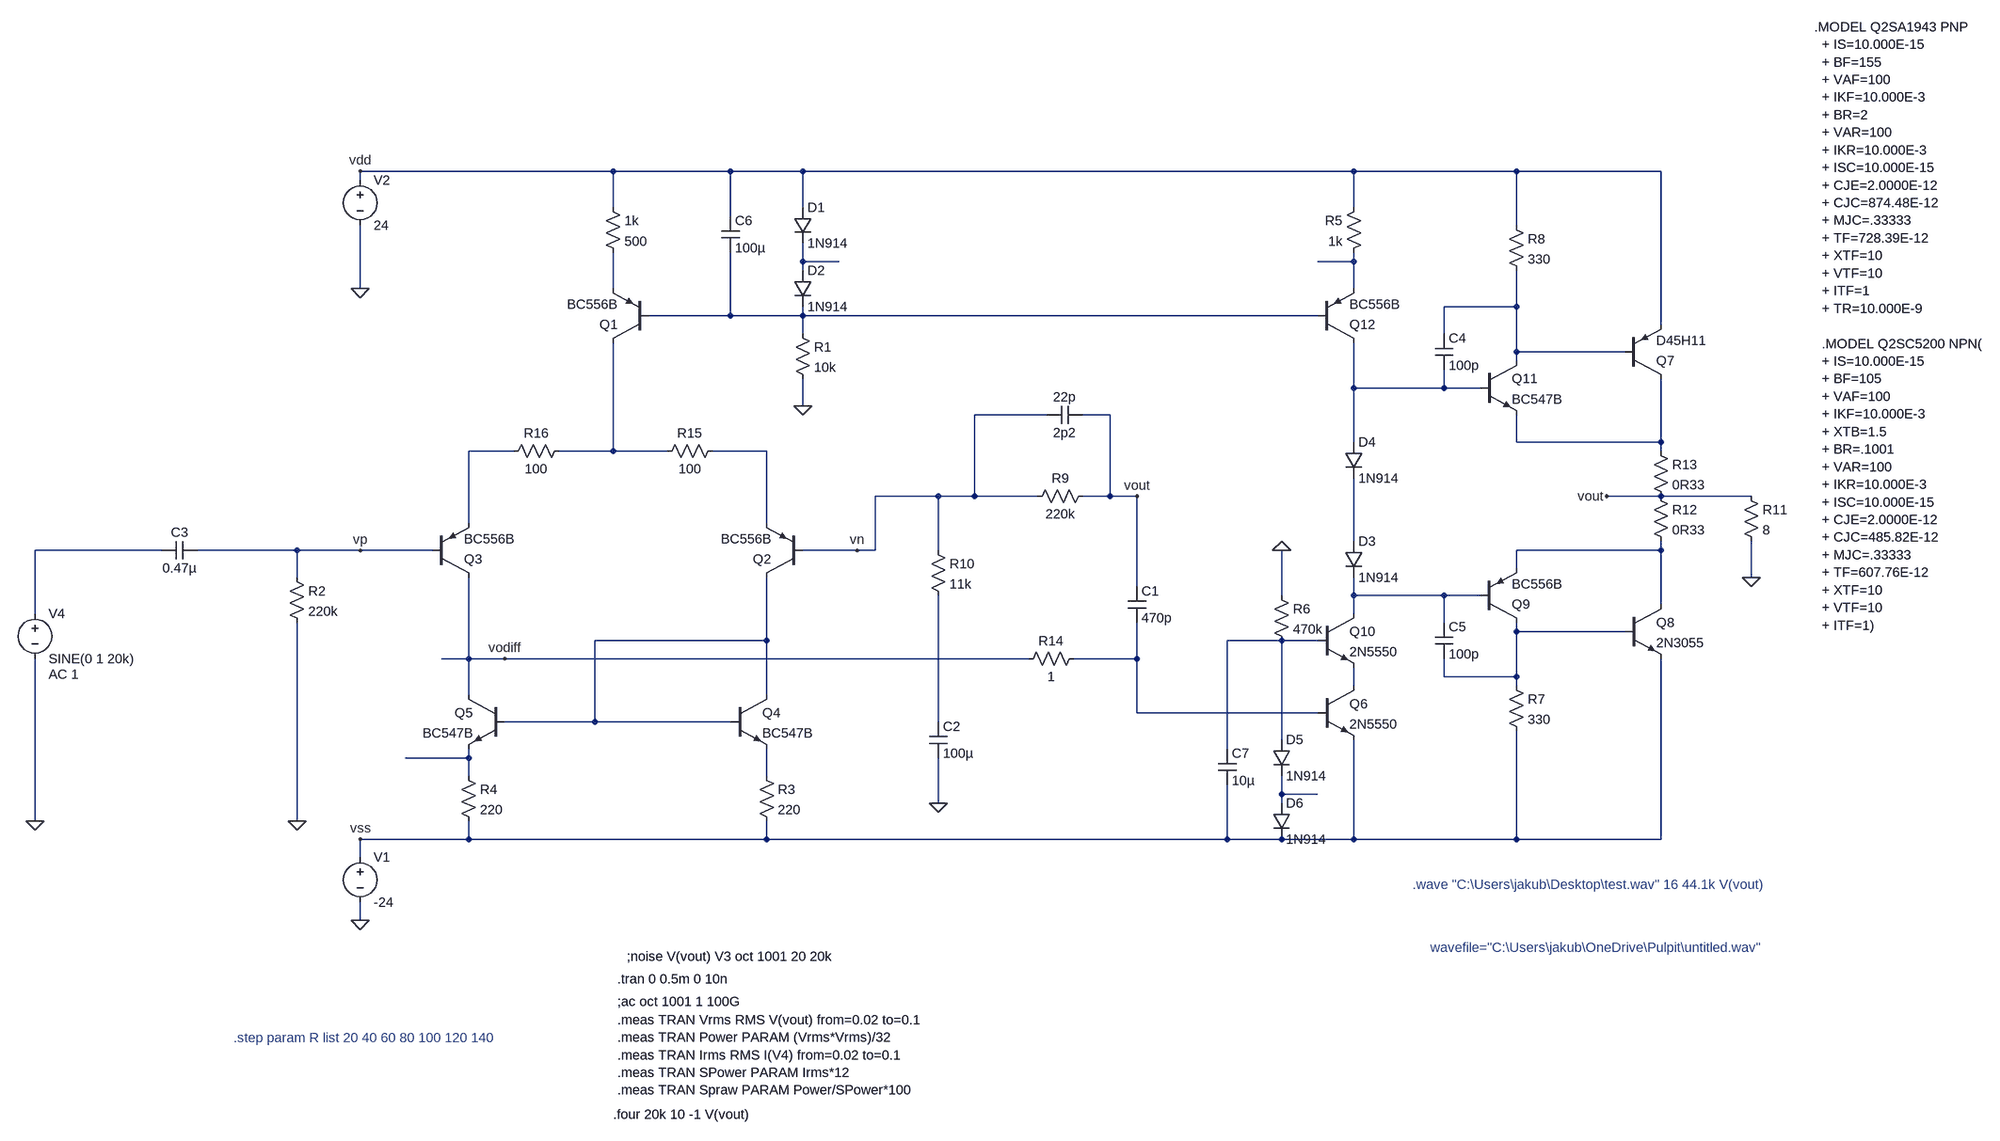
[diagram p0: schematic Draft7.asc]
Draft7.asc, the LTspice schematic file:
Version 4
SHEET 1 2016 2028
WIRE -416 -544 -864 -544
WIRE -208 -544 -416 -544
WIRE -80 -544 -208 -544
WIRE 896 -544 -80 -544
WIRE 1184 -544 896 -544
WIRE 1440 -544 1184 -544
WIRE -864 -528 -864 -544
WIRE -416 -480 -416 -544
WIRE -80 -480 -80 -544
WIRE 896 -480 896 -544
WIRE -208 -464 -208 -544
WIRE 1184 -448 1184 -544
WIRE -80 -384 -80 -416
WIRE -16 -384 -80 -384
WIRE 896 -384 896 -400
WIRE 896 -384 832 -384
WIRE -80 -368 -80 -384
WIRE -864 -336 -864 -448
WIRE -416 -336 -416 -400
WIRE 896 -336 896 -384
WIRE 1184 -304 1184 -368
WIRE 1184 -304 1056 -304
WIRE -208 -288 -208 -400
WIRE -208 -288 -352 -288
WIRE -80 -288 -80 -304
WIRE -80 -288 -208 -288
WIRE 832 -288 -80 -288
WIRE 1440 -272 1440 -544
WIRE -80 -256 -80 -288
WIRE 1056 -256 1056 -304
WIRE 1184 -224 1184 -304
WIRE 1376 -224 1184 -224
WIRE 1184 -208 1184 -224
WIRE 896 -160 896 -240
WIRE 1056 -160 1056 -192
WIRE 1056 -160 896 -160
WIRE 1120 -160 1056 -160
WIRE -80 -128 -80 -176
WIRE 352 -112 224 -112
WIRE 464 -112 416 -112
WIRE 896 -64 896 -160
WIRE 1184 -64 1184 -112
WIRE 1440 -64 1440 -176
WIRE 1440 -64 1184 -64
WIRE -592 -48 -672 -48
WIRE -416 -48 -416 -240
WIRE -416 -48 -512 -48
WIRE -320 -48 -416 -48
WIRE -144 -48 -240 -48
WIRE 1440 -48 1440 -64
WIRE 160 32 48 32
WIRE 224 32 224 -112
WIRE 224 32 160 32
WIRE 336 32 224 32
WIRE 464 32 464 -112
WIRE 464 32 416 32
WIRE 512 32 464 32
WIRE 1440 32 1344 32
WIRE 1600 32 1440 32
WIRE -672 80 -672 -48
WIRE -144 80 -144 -48
WIRE 896 112 896 0
WIRE -1216 128 -1440 128
WIRE -976 128 -1152 128
WIRE -864 128 -976 128
WIRE -736 128 -864 128
WIRE 16 128 -80 128
WIRE 48 128 48 32
WIRE 48 128 16 128
WIRE 160 128 160 32
WIRE 1440 128 1440 112
WIRE 1440 128 1184 128
WIRE 1184 160 1184 128
WIRE -976 176 -976 128
WIRE 1600 176 1600 112
WIRE 512 192 512 32
WIRE 768 208 768 128
WIRE 896 208 896 176
WIRE 1056 208 896 208
WIRE 1120 208 1056 208
WIRE 1440 224 1440 128
WIRE -1440 240 -1440 128
WIRE 896 240 896 208
WIRE 1056 256 1056 208
WIRE 1184 272 1184 256
WIRE 1376 272 1184 272
WIRE -144 288 -144 176
WIRE -144 288 -448 288
WIRE 768 288 672 288
WIRE 832 288 768 288
WIRE -672 320 -672 176
WIRE -672 320 -720 320
WIRE -608 320 -672 320
WIRE 320 320 -608 320
WIRE 512 320 512 256
WIRE 512 320 400 320
WIRE 1056 352 1056 320
WIRE 1184 352 1184 272
WIRE 1184 352 1056 352
WIRE 896 368 896 336
WIRE 1184 368 1184 352
WIRE -672 384 -672 320
WIRE -144 384 -144 288
WIRE 512 416 512 320
WIRE 832 416 512 416
WIRE -448 432 -448 288
WIRE -448 432 -608 432
WIRE -208 432 -448 432
WIRE 160 432 160 208
WIRE 768 464 768 288
WIRE 672 480 672 288
WIRE -672 496 -672 480
WIRE -672 496 -784 496
WIRE -672 528 -672 496
WIRE -144 528 -144 480
WIRE 768 560 768 528
WIRE 832 560 768 560
WIRE 160 576 160 496
WIRE 768 576 768 560
WIRE -1440 608 -1440 320
WIRE -976 608 -976 256
WIRE -672 640 -672 608
WIRE -672 640 -864 640
WIRE -144 640 -144 608
WIRE -144 640 -672 640
WIRE 672 640 672 544
WIRE 672 640 -144 640
WIRE 768 640 672 640
WIRE 896 640 896 464
WIRE 896 640 768 640
WIRE 1184 640 1184 448
WIRE 1184 640 896 640
WIRE 1440 640 1440 320
WIRE 1440 640 1184 640
WIRE -864 672 -864 640
WIRE -864 784 -864 752
FLAG -864 -544 vdd
FLAG -1440 608 0
FLAG -864 640 vss
FLAG 1344 32 vout
FLAG 1600 176 0
FLAG -864 784 0
FLAG -80 -128 0
FLAG -864 -336 0
FLAG 768 128 0
FLAG 160 576 0
FLAG -864 128 vp
FLAG 16 128 vn
FLAG -608 320 vodiff
FLAG 512 32 vout
FLAG -976 608 0
DATAFLAG -704 320 ""
DATAFLAG 1552 32 ""
DATAFLAG 160 640 ""
DATAFLAG 128 -544 ""
DATAFLAG 832 -384 ""
DATAFLAG 688 288 ""
DATAFLAG -784 128 ""
DATAFLAG -48 128 ""
DATAFLAG -256 -288 ""
DATAFLAG -416 -368 ""
DATAFLAG 896 352 ""
DATAFLAG -784 496 ""
DATAFLAG 1024 208 ""
DATAFLAG 992 -160 ""
SYMBOL diode -96 -480 R0
SYMATTR InstName D1
SYMATTR Value 1N914
SYMBOL diode -96 -368 R0
SYMATTR InstName D2
SYMATTR Value 1N914
SYMBOL res -96 -272 R0
SYMATTR InstName R1
SYMATTR Value 10k
SYMBOL pnp -352 -240 R180
SYMATTR InstName Q1
SYMATTR Value BC556B
SYMBOL res -432 -496 R0
SYMATTR InstName 1k
SYMATTR Value 500
SYMBOL pnp -80 176 R180
SYMATTR InstName Q2
SYMATTR Value BC556B
SYMBOL pnp -736 176 M180
SYMATTR InstName Q3
SYMATTR Value BC556B
SYMBOL voltage -864 656 R0
WINDOW 123 0 0 Left 0
WINDOW 39 0 0 Left 0
SYMATTR InstName V1
SYMATTR Value -24
SYMBOL npn -208 384 R0
SYMATTR InstName Q4
SYMATTR Value BC547B
SYMBOL npn -608 384 M0
SYMATTR InstName Q5
SYMATTR Value BC547B
SYMBOL npn 832 368 R0
SYMATTR InstName Q6
SYMATTR Value 2N5550
SYMBOL diode 880 112 R0
SYMATTR InstName D3
SYMATTR Value 1N914
SYMBOL diode 880 -64 R0
SYMATTR InstName D4
SYMATTR Value 1N914
SYMBOL res 1168 352 R0
SYMATTR InstName R7
SYMATTR Value 330
SYMBOL res 1168 -464 R0
SYMATTR InstName R8
SYMATTR Value 330
SYMBOL pnp 1120 256 M180
SYMATTR InstName Q9
SYMATTR Value BC556B
SYMBOL npn 1120 -208 R0
SYMATTR InstName Q11
SYMATTR Value BC547B
SYMBOL voltage -864 -544 R0
WINDOW 123 0 0 Left 0
WINDOW 39 0 0 Left 0
SYMATTR InstName V2
SYMATTR Value 24
SYMBOL res 1584 16 R0
SYMATTR InstName R11
SYMATTR Value 8
SYMBOL res 1424 16 R0
SYMATTR InstName R12
SYMATTR Value 0R33
SYMBOL res 1424 -64 R0
SYMATTR InstName R13
SYMATTR Value 0R33
SYMBOL pnp 1376 -176 M180
SYMATTR InstName Q7
SYMATTR Value D45H11
SYMBOL npn 1376 224 R0
SYMATTR InstName Q8
SYMATTR Value 2N3055
SYMBOL cap 1040 256 R0
SYMATTR InstName C5
SYMATTR Value 100p
SYMBOL diode 752 464 R0
SYMATTR InstName D5
SYMATTR Value 1N914
SYMBOL diode 752 576 R0
SYMATTR InstName D6
SYMATTR Value 1N914
SYMBOL res 752 192 R0
SYMATTR InstName R6
SYMATTR Value 470k
SYMBOL cap 496 192 R0
SYMATTR InstName C1
SYMATTR Value 470p
SYMBOL pnp 832 -240 M180
SYMATTR InstName Q12
SYMATTR Value BC556B
SYMBOL res 912 -496 M0
SYMATTR InstName R5
SYMATTR Value 1k
SYMBOL res 432 16 R90
WINDOW 0 0 56 VBottom 2
WINDOW 3 32 56 VTop 2
SYMATTR InstName R9
SYMATTR Value 220k
SYMBOL res 144 112 R0
SYMATTR InstName R10
SYMATTR Value 11k
SYMBOL cap 144 432 R0
SYMATTR InstName C2
SYMATTR Value 100µ
SYMBOL cap -224 -464 R0
SYMATTR InstName C6
SYMATTR Value 100µ
SYMBOL cap 656 480 R0
SYMATTR InstName C7
SYMATTR Value 10µ
SYMBOL res -688 512 R0
SYMATTR InstName R4
SYMATTR Value 220
SYMBOL res -160 512 R0
SYMATTR InstName R3
SYMATTR Value 220
SYMBOL voltage -1440 224 R0
WINDOW 123 24 124 Left 2
WINDOW 39 0 0 Left 0
SYMATTR Value2 AC 1
SYMATTR InstName V4
SYMATTR Value SINE(0 1 20k)
SYMBOL res -224 -64 R90
WINDOW 0 0 56 VBottom 2
WINDOW 3 32 56 VTop 2
SYMATTR InstName R15
SYMATTR Value 100
SYMBOL res -496 -64 R90
WINDOW 0 0 56 VBottom 2
WINDOW 3 32 56 VTop 2
SYMATTR InstName R16
SYMATTR Value 100
SYMBOL cap 1040 -256 R0
SYMATTR InstName C4
SYMATTR Value 100p
SYMBOL cap 416 -128 R90
WINDOW 0 0 32 VBottom 2
WINDOW 3 32 32 VTop 2
SYMATTR InstName 22p
SYMATTR Value 2p2
SYMBOL res -992 160 R0
SYMATTR InstName R2
SYMATTR Value 220k
SYMBOL cap -1152 112 R90
WINDOW 0 0 32 VBottom 2
WINDOW 3 32 32 VTop 2
SYMATTR InstName C3
SYMATTR Value 0.47µ
SYMBOL res 416 304 R90
WINDOW 0 0 56 VBottom 2
WINDOW 3 32 56 VTop 2
SYMATTR InstName R14
SYMATTR Value 1
SYMBOL npn 832 240 R0
SYMATTR InstName Q10
SYMATTR Value 2N5550
TEXT -408 928 Left 2 !;ac oct 1001 1 100G
TEXT -408 960 Left 2 !.meas TRAN Vrms RMS V(vout) from=0.02 to=0.1\n.meas TRAN Power PARAM (Vrms*Vrms)/32\n.meas TRAN Irms RMS I(V4) from=0.02 to=0.1\n.meas TRAN SPower PARAM Irms*12\n.meas TRAN Spraw PARAM Power/SPower*100
TEXT 1712 -800 Left 2 !.MODEL Q2SA1943 PNP\n  + IS=10.000E-15\n  + BF=155\n  + VAF=100\n  + IKF=10.000E-3\n  + BR=2\n  + VAR=100\n  + IKR=10.000E-3\n  + ISC=10.000E-15\n  + CJE=2.0000E-12\n  + CJC=874.48E-12\n  + MJC=.33333\n  + TF=728.39E-12\n  + XTF=10\n  + VTF=10\n  + ITF=1\n  + TR=10.000E-9\n \n  .MODEL Q2SC5200 NPN(\n  + IS=10.000E-15\n  + BF=105\n  + VAF=100\n  + IKF=10.000E-3\n  + XTB=1.5\n  + BR=.1001\n  + VAR=100\n  + IKR=10.000E-3\n  + ISC=10.000E-15\n  + CJE=2.0000E-12\n  + CJC=485.82E-12\n  + MJC=.33333\n  + TF=607.76E-12\n  + XTF=10\n  + VTF=10\n  + ITF=1)
TEXT -408 888 Left 2 !.tran 0 0.5m 0 10n
TEXT -416 1128 Left 2 !.four 20k 10 -1 V(vout)
TEXT 1000 720 Left 2 ;.wave "C:\\Users\\jakub\\Desktop\\test.wav" 16 44.1k V(vout)
TEXT 1032 832 Left 2 ;wavefile="C:\\Users\\jakub\\OneDrive\\Pulpit\\untitled.wav"
TEXT -392 848 Left 2 !;noise V(vout) V3 oct 1001 20 20k
TEXT -1088 992 Left 2 ;.step param R list 20 40 60 80 100 120 140

The netlist it stands for:
* Draft7.asc
D1 vdd N001 1N914
D2 N001 N005 1N914
R1 N005 0 10k
Q1 N009 N005 N003 0 BC556B
R§1k vdd N003 500
Q2 N016 vn N010 0 BC556B
Q3 vodiff vp N008 0 BC556B
V1 vss 0 -24
Q4 N016 N016 N022 0 BC547B
Q5 vodiff N016 N021 0 BC547B
Q6 N019 N018 vss 0 2N5550
D3 N011 N014 1N914
D4 N006 N011 1N914
R7 N015 vss 330
R8 vdd N004 330
Q9 N015 N014 N013 0 BC556B
Q11 N004 N006 N007 0 BC547B
V2 vdd 0 24
R11 vout 0 8
R12 vout N013 0R33
R13 N007 vout 0R33
Q7 N007 N004 vdd 0 D45H11
Q8 N013 N015 vss 0 2N3055
C5 N014 N015 100p
D5 N017 N023 1N914
D6 N023 vss 1N914
R6 0 N017 470k
C1 vout N018 470p
Q12 N006 N005 N002 0 BC556B
R5 vdd N002 1k
R9 vout vn 220k
R10 vn N020 11k
C2 N020 0 100µ
C6 vdd N005 100µ
C7 N017 vss 10µ
R4 N021 vss 220
R3 N022 vss 220
V4 N012 0 SINE(0 1 20k) AC 1
R15 N010 N009 100
R16 N009 N008 100
C4 N004 N006 100p
C§22p vout vn 2p2
R2 vp 0 220k
C3 vp N012 0.47µ
R14 N018 vodiff 1
Q10 N014 N017 N019 0 2N5550
.model D D
.lib standard.dio
.model NPN NPN
.model PNP PNP
.lib standard.bjt
;ac oct 1001 1 100G
.meas TRAN Vrms RMS V(vout) from=0.02 to=0.1
.meas TRAN Power PARAM (Vrms*Vrms)/32
.meas TRAN Irms RMS I(V4) from=0.02 to=0.1
.meas TRAN SPower PARAM Irms*12
.meas TRAN Spraw PARAM Power/SPower*100
.MODEL Q2SA1943 PNP
  + IS=10.000E-15
  + BF=155
  + VAF=100
  + IKF=10.000E-3
  + BR=2
  + VAR=100
  + IKR=10.000E-3
  + ISC=10.000E-15
  + CJE=2.0000E-12
  + CJC=874.48E-12
  + MJC=.33333
  + TF=728.39E-12
  + XTF=10
  + VTF=10
  + ITF=1
  + TR=10.000E-9
  .MODEL Q2SC5200 NPN(
  + IS=10.000E-15
  + BF=105
  + VAF=100
  + IKF=10.000E-3
  + XTB=1.5
  + BR=.1001
  + VAR=100
  + IKR=10.000E-3
  + ISC=10.000E-15
  + CJE=2.0000E-12
  + CJC=485.82E-12
  + MJC=.33333
  + TF=607.76E-12
  + XTF=10
  + VTF=10
  + ITF=1)
.tran 0 0.5m 0 10n
.four 20k 10 -1 V(vout)
* .wave "C:\Users\jakub\Desktop\test.wav" 16 44.1k V(vout)
* wavefile="C:\Users\jakub\OneDrive\Pulpit\untitled.wav"
;noise V(vout) V3 oct 1001 20 20k
* .step param R list 20 40 60 80 100 120 140
.backanno
.end